# EasyEDA Pro project ProPrj_时移LLC开发板_2025-06-07.epro, board PCB1_1
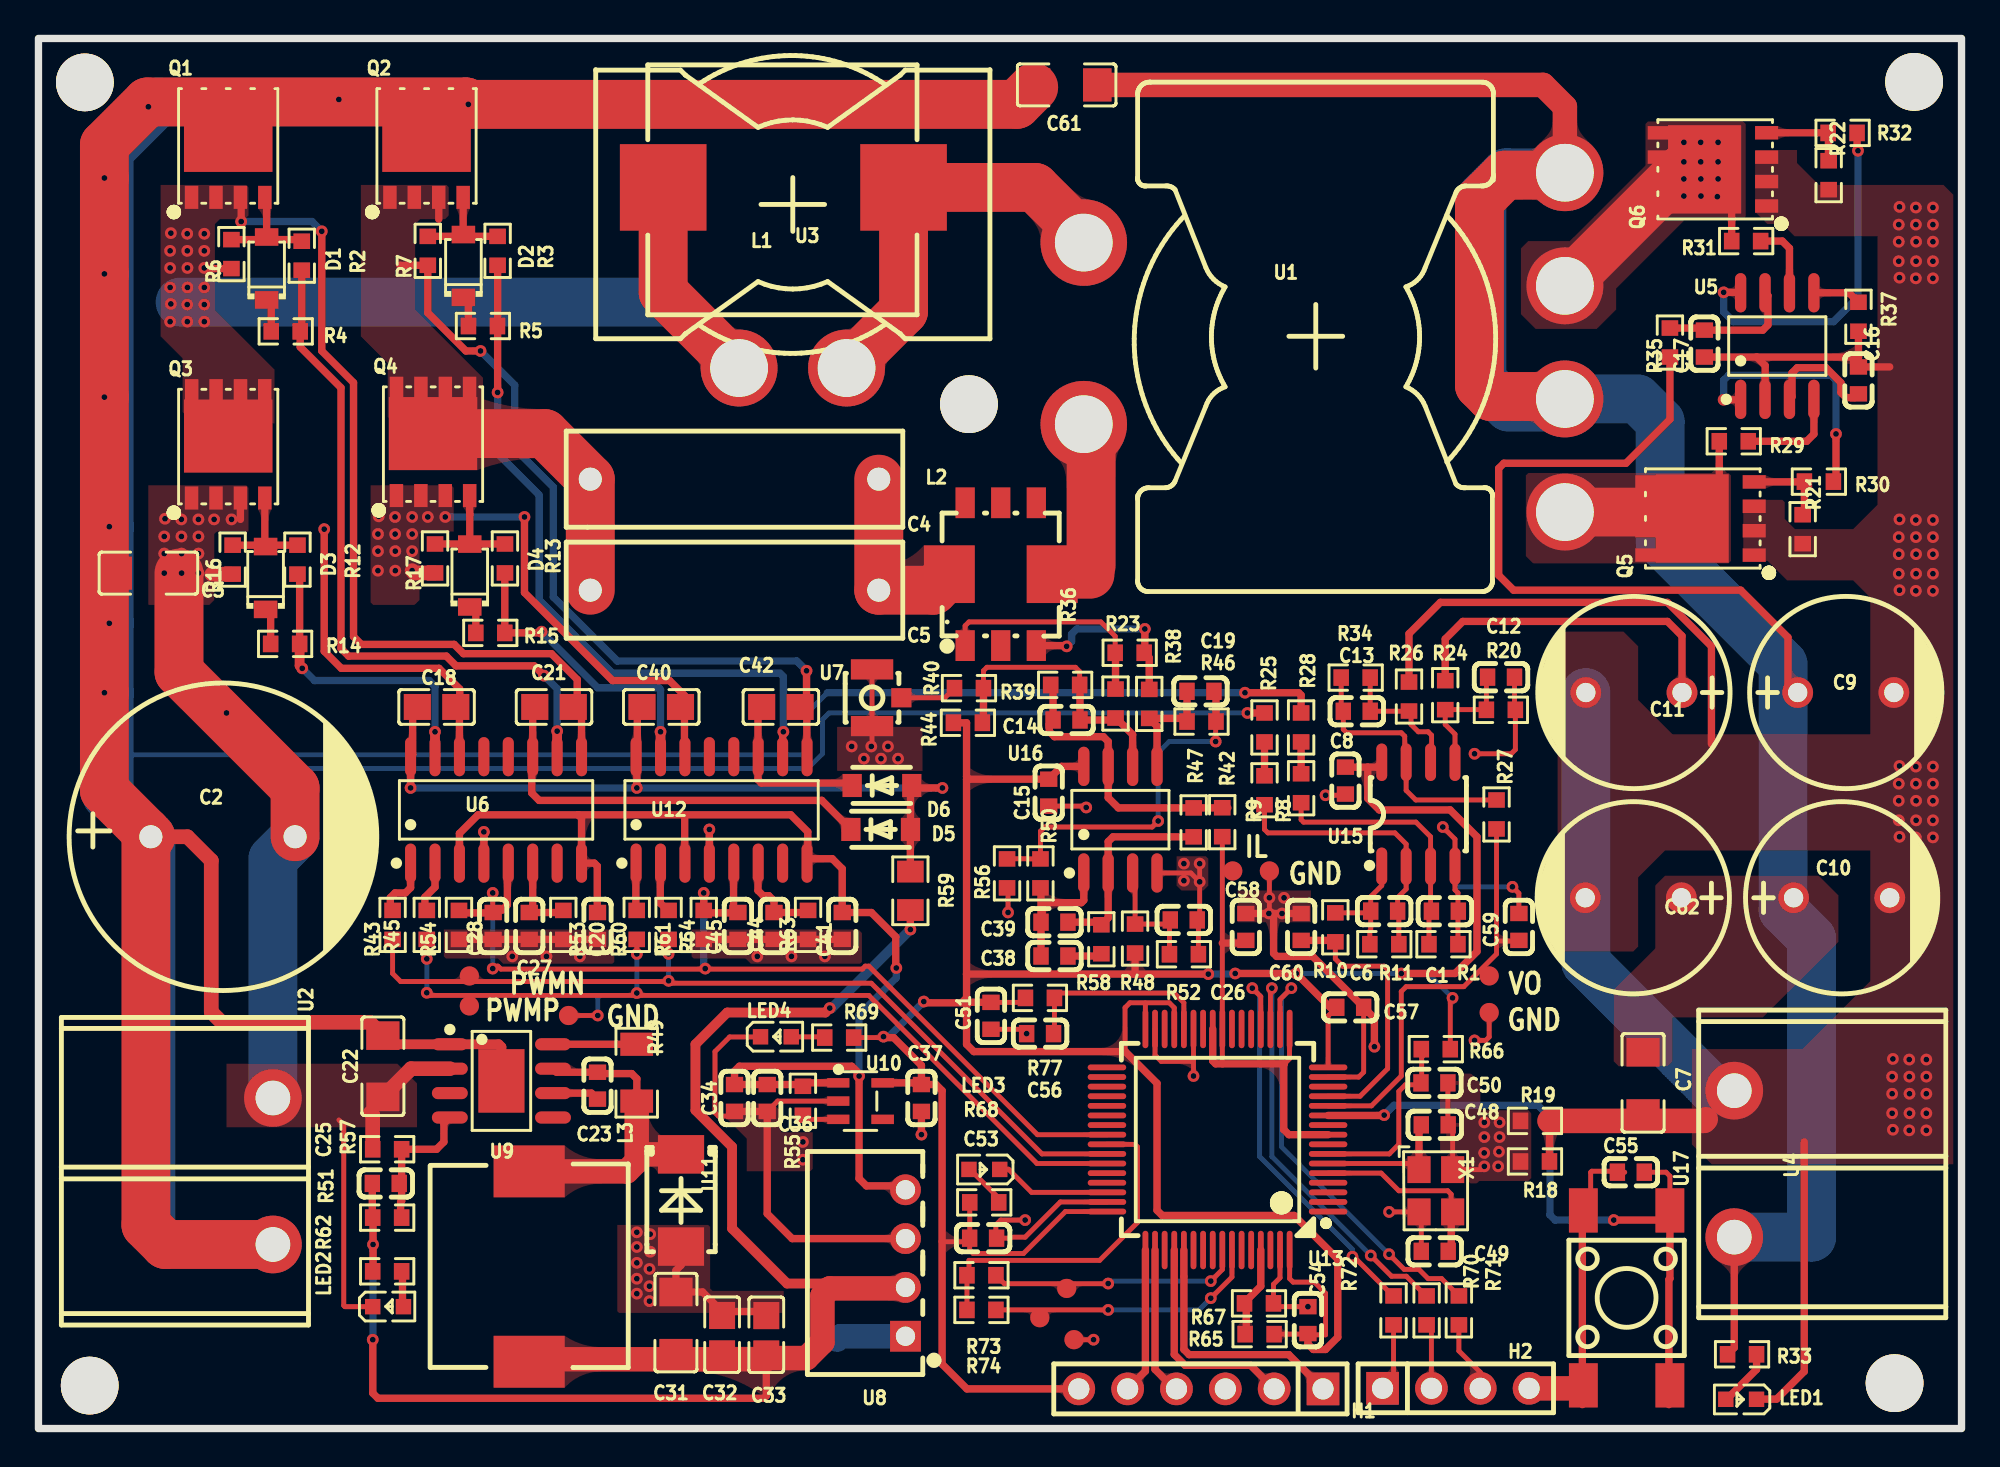
[diagram p1: board, top side]
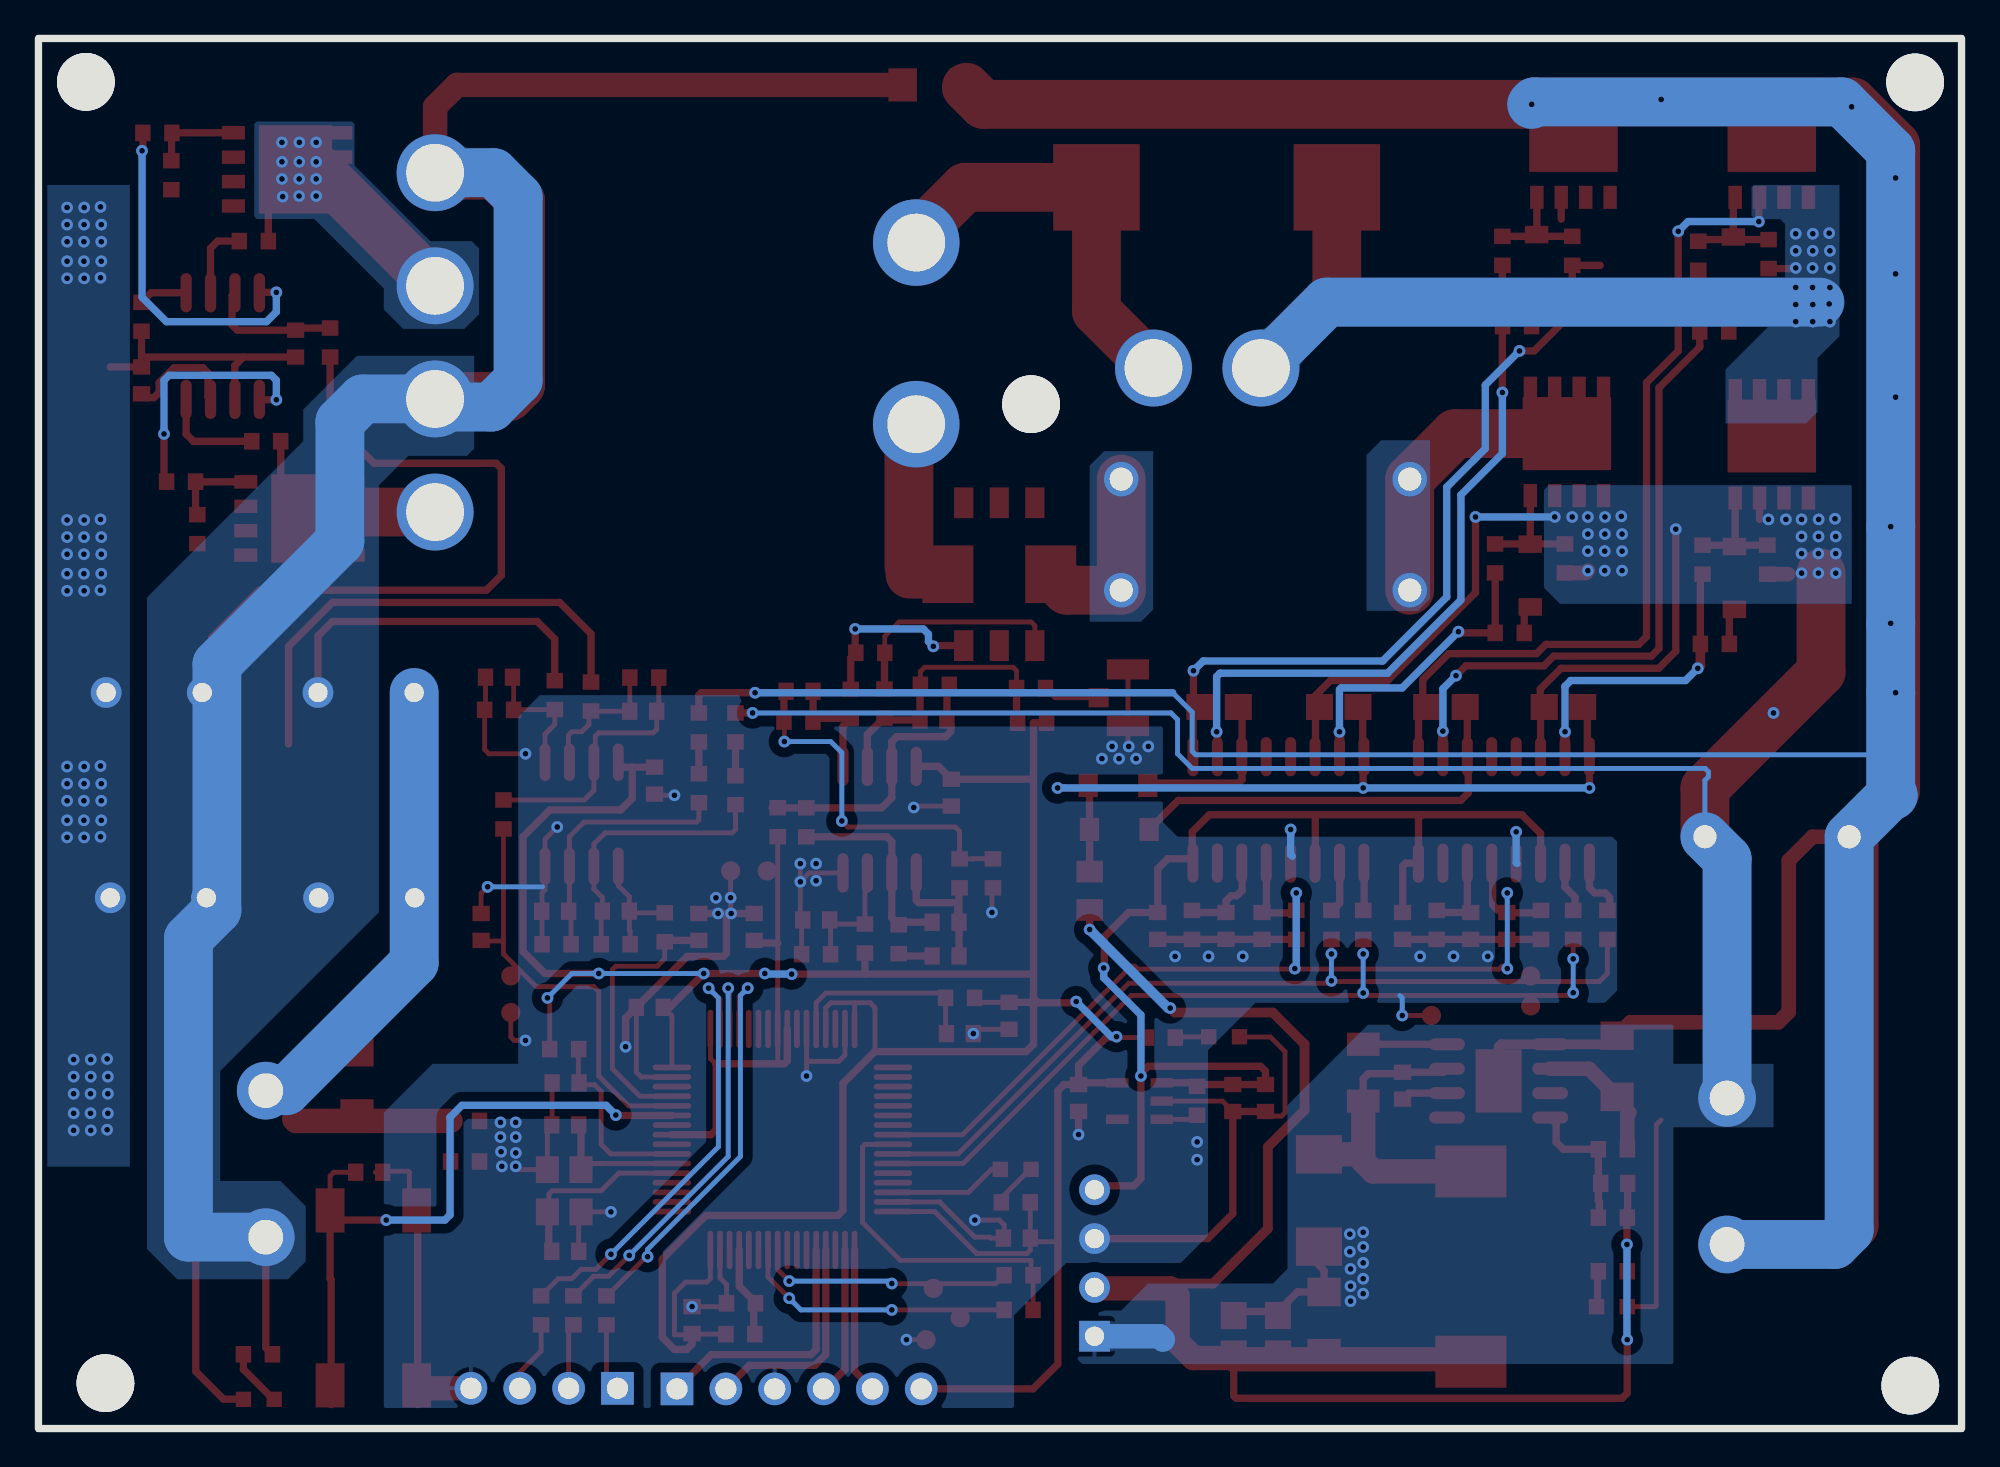
[diagram p2: board, bottom side, seen from below]

Outline 100 x 72.31 mm; copper layers: Top Layer, Bottom Layer. Coordinates in mm from the lower left corner of the outline.
Outline path: rectangle 0,72.31 100,0
Stack: Top Layer 0.035mm / Dielectric1 1.51mm FR4 er 4.5 / Bottom Layer 0.035mm

## Design rules (mm)
template: 自定义配置
spacing copperThickness1oz (default): track to track 0.102, other pairs 0.152 to 0.3
spacing copperThickness2oz: track to track 0.203, other pairs 0.152 to 0.3
track width copperThickness1oz (default): min 0.127, default 0.254, max 2.54
track width copperThickness2oz: min 0.203, default 0.254, max 2.54
differential pair differentialPair (default): width min 0.127, default 0.254, max 2.54; gap min 0.152, default 0.152
via viaSize (default): diameter min 0.5, default 0.61, max 10; hole min 0.3, default 0.305, max 6.299

## Placement (name value [footprint] x y rotation side)
C1  1nF  [C0603]  73.13 26.91 0 top
C2  470uF  [CAP-TH_BD16.0-P7.50-D1.2-FD]  9.59 30.78 0 top
C3  100nF  [C1206]  5.72 44.5 180 top
C4  100nF  [CAP-TH_L17.5-W5.0-P15.00-D1.2]  36.19 49.39 180 top
C5  100nF  [CAP-TH_L17.5-W5.0-P15.00-D1.2]  36.19 43.61 180 top
C6  1nF  [C0603]  69.98 26.92 180 top
C7  1uF  [C1206]  83.44 17.98 90 top
C8  100nF  [C0603]  67.96 33.71 90 top
C9  1000uF  [CAP-TH_BD10.0-P5.00-D0.6-FD-A]  93.98 38.29 0 top
C10  1000uF  [CAP-TH_BD10.0-P5.00-D0.6-FD-A]  93.77 27.61 0 top
C11  1000uF  [CAP-TH_BD10.0-P5.00-D0.6-FD-A]  82.96 38.29 180 top
C12  1nF  [C0603]  76.05 39.09 0 top
C13  1nF  [C0603]  68.55 37.31 180 top
C14  100pF  [C0603]  53.46 36.86 180 top
C15  100nF  [C0603]  52.53 33.08 90 top
C16  1uF  [C0603]  94.64 54.53 270 top
C17  1uF  [C0603]  86.63 56.44 90 top
C18  100nF  [C0805]  20.7 37.54 180 top
C19  100pF  [C0603]  60.42 38.35 0 top
C20  100nF  [C0603]  29.07 26.14 90 top
C21  1uF  [C0805]  26.81 37.54 180 top
C22  1uF  [C1206]  17.91 18.85 90 top
C23  100nF  [C0603]  29.07 17.84 90 top
C25  10nF  [C0603]  18.06 12.75 180 top
C26  10nF  [C0603]  59.56 26.46 180 top
C27  10nF  [C0603]  25.52 26.14 90 top
C28  10nF  [C0603]  23.64 26.14 90 top
C31  100nF  [C1206]  33.15 5.51 270 top
C32  10uF  [C0805]  35.55 4.88 270 top
C33  100nF  [C0805]  37.85 4.88 270 top
C34  4.7uF  [C0603]  36.19 17.2 90 top
C36  100nF  [C0603]  37.9 17.2 90 top
C37  1uF  [C0603]  45.91 17.2 90 top
C38  100nF  [C0603]  52.83 24.58 180 top
C39  100nF  [C0603]  52.83 26.34 180 top
C40  100nF  [C0805]  32.38 37.54 180 top
C41  100nF  [C0603]  41.8 26.14 90 top
C42  1uF  [C0805]  38.61 37.54 180 top
C44  10nF  [C0603]  38.25 26.14 90 top
C45  10nF  [C0603]  36.37 26.14 90 top
C48  100nF  [C0603]  72.59 17.98 180 top
C49  22pF  [C0603]  72.61 9.22 0 top
C50  22pF  [C0603]  72.61 15.8 0 top
C51  100nF  [C0603]  49.53 21.47 90 top
C53  100nF  [C0603]  49.12 9.91 180 top
C54  100nF  [C0603]  66.01 5.64 270 top
C55  100nF  [C0603]  82.8 13.33 0 top
C56  1uF  [C0603]  52.09 20.55 0 top
C57  100nF  [C0603]  68.21 21.91 180 top
C58  100pF  [C0603]  62.78 26.09 90 top
C59  10nF  [C0603]  76.98 26.09 90 top
C60  1nF  [C0603]  65.66 26.09 90 top
C61  100nF  [C1206]  53.47 69.9 180 top
C62  1000uF  [CAP-TH_BD10.0-P5.00-D0.6-FD-A]  82.93 27.61 180 top
D1  1N5819W  [SOD-123_L2.7-W1.6-LS3.7-RD]  11.86 60.35 90 top
D2  1N5819W  [SOD-123_L2.7-W1.6-LS3.7-RD]  22.1 60.48 90 top
D3  1N5819W  [SOD-123_L2.7-W1.6-LS3.7-RD]  11.81 44.25 90 top
D4  1N5819W  [SOD-123_L2.7-W1.6-LS3.7-RD]  22.43 44.37 90 top
D5  ES1JW  [SOD-123F_L2.8-W1.8-LS3.7-RD]  43.8 31.17 0 top
D6  ES1JW  [SOD-123F_L2.8-W1.8-LS3.7-RD]  43.86 33.45 0 top
H1  PZ254V-11-06P  [HDR-TH_6P-P2.54-V-M]  60.45 2.06 180 top
H2  PZ254V-11-04P  [HDR-TH_4P-P2.54-V-M]  73.7 2.09 0 top
L1  15uH  [IND-SMD_L13.8-W12.6]  38.74 64.57 0 top
L2  FC-SCT5.0-1:100-20A  [IND-SMD_6P-L6.2-W6.0-P1.85-LS8.1_FC-SCT5.0-1]  50.04 44.44 0 top
L3  330uH  [IND-SMD_L10.5-W10.3_SLD10D50]  25.52 8.43 270 top
LED1  KT-0603R  [LED0603-RD]  88.54 1.52 180 top
LED2  LTST-C190KGKT  [LED0603-RD]  18.18 6.34 0 top
LED3  KT-0603R  [LED0603-RD]  49.19 13.48 180 top
LED4  KT-0603R  [LED0603-RD]  38.35 20.38 0 top
NOREF  -  [Pad_e3116]  22.41 21.99 0 top
NOREF#2  -  [Pad_e3285]  52.07 5.77 0 top
NOREF#3  -  [Pad_e338]  48.38 53.29 0 top
NOREF#4  -  [Pad_e3133]  64.01 29.01 0 top
NOREF#5  -  [Pad_e3126]  75.44 21.64 0 top
NOREF#6  -  [Pad_e3125]  75.44 23.55 0 top
NOREF#7  -  [Pad_e3120]  27.57 21.49 0 top
NOREF#8  -  [Pad_e240]  96.52 2.36 0 top
NOREF#9  -  [Pad_e3132]  62.1 29.01 0 top
NOREF#10  -  [Pad_e250]  97.53 70.05 0 top
NOREF#11  -  [Pad_e251]  2.41 70.03 0 top
NOREF#12  -  [Pad_e337]  2.67 2.24 0 top
NOREF#13  -  [Pad_e3287]  53.85 4.62 0 top
NOREF#14  -  [Pad_e3117]  22.41 23.55 0 top
NOREF#15  -  [Pad_e3286]  53.47 7.29 0 top
Q1  AGM4025A  [PDFN-8_L5.8-W4.9-P1.27-LS6.1-BL]  9.87 66.84 0 top
Q2  AGM4025A  [PDFN-8_L5.8-W4.9-P1.27-LS6.1-BL]  20.18 66.84 0 top
Q3  AGM4025A  [PDFN-8_L5.8-W4.9-P1.27-LS6.1-BL]  9.87 51.2 0 top
Q4  AGM4025A  [PDFN-8_L5.8-W4.9-P1.27-LS6.1-BL]  20.52 51.33 0 top
Q5  AGM4025A  [PDFN-8_L5.8-W4.9-P1.27-LS6.1-BL]  86.43 47.34 90 top
Q6  AGM4025A  [PDFN-8_L5.8-W4.9-P1.27-LS6.1-BL]  87.07 65.5 90 top
R1  2kΩ  [R0603]  73.06 25.2 0 top
R2  10Ω  [R0603]  13.69 61.01 270 top
R3  10Ω  [R0603]  23.88 61.27 270 top
R4  10Ω  [R0603]  12.86 57.08 0 top
R5  10Ω  [R0603]  23.11 57.35 0 top
R6  10kΩ  [R0603]  10.03 61.1 270 top
R7  10kΩ  [R0603]  20.25 61.27 270 top
R8  10kΩ  [R0603]  65.66 33.31 270 top
R9  10kΩ  [R0603]  63.75 33.2 270 top
R10  100Ω  [R0603]  67.44 26.08 270 top
R11  2kΩ  [R0603]  69.98 25.2 0 top
R12  10Ω  [R0603]  13.47 45.2 270 top
R13  10Ω  [R0603]  24.26 45.26 270 top
R14  10Ω  [R0603]  12.83 40.82 0 top
R15  10Ω  [R0603]  23.5 41.39 0 top
R16  10kΩ  [R0603]  10.1 45.2 270 top
R17  10kΩ  [R0603]  20.62 45.26 270 top
R18  0Ω  [R0603]  77.82 13.89 0 top
R19  0Ω  [R0603]  77.82 16 0 top
R20  1kΩ  [R0603]  76.05 37.39 0 top
R21  10kΩ  [R0603]  91.74 46.79 270 top
R22  10kΩ  [R0603]  93.09 65.2 270 top
R23  2.2Ω  [R0603]  56.74 40.36 180 top
R24  10kΩ  [R0603]  73.15 38.15 270 top
R25  47kΩ  [R0603]  63.75 36.47 90 top
R26  10kΩ  [R0603]  71.27 38.08 270 top
R27  100Ω  [R0603]  75.82 31.95 270 top
R28  47kΩ  [R0603]  65.66 36.47 90 top
R29  1kΩ  [R0603]  88.16 51.36 180 top
R30  10Ω  [R0603]  92.58 49.26 180 top
R31  1kΩ  [R0603]  88.8 61.77 180 top
R32  10Ω  [R0603]  93.82 67.4 180 top
R33  47kΩ  [R0603]  88.59 3.86 0 top
R34  1kΩ  [R0603]  68.5 39.06 180 top
R35  10Ω  [R0603]  84.84 56.49 270 top
R36  1kΩ  [R0603]  56.01 37.71 270 top
R37  100Ω  [R0603]  94.64 57.84 90 top
R38  1kΩ  [R0603]  57.76 37.7 270 top
R39  4.7kΩ  [R0603]  53.39 38.68 180 top
R40  1kΩ  [R0603]  48.39 38.52 0 top
R42  100Ω  [R0603]  61.56 31.54 270 top
R43  100Ω  [R0603]  18.42 26.2 90 top
R44  1kΩ  [R0603]  48.33 36.71 0 top
R45  100Ω  [R0603]  20.19 26.2 90 top
R46  4.7kΩ  [R0603]  60.48 36.78 0 top
R47  470kΩ  [R0603]  60.07 31.53 90 top
R48  10kΩ  [R0603]  57.02 25.49 270 top
R49  100mΩ  [R1206]  31.11 18.51 90 top
R50  10Ω  [R0603]  52.1 28.88 270 top
R51  8.2kΩ  [R0603]  18.13 10.97 180 top
R52  10kΩ  [R0603]  59.56 24.67 180 top
R53  10kΩ  [R0603]  27.29 26.2 90 top
R54  10kΩ  [R0603]  21.87 26.2 270 top
R55  10kΩ  [R0603]  39.75 17.05 90 top
R56  10kΩ  [R0603]  50.37 28.88 90 top
R57  1kΩ  [R0603]  18.13 14.53 0 top
R58  470Ω  [R0603]  55.27 25.45 270 top
R59  4.7Ω  [R0805]  45.34 27.97 90 top
R60  100Ω  [R0603]  31.11 26.2 90 top
R61  100Ω  [R0603]  32.77 26.2 90 top
R62  47kΩ  [R0603]  18.13 8.18 180 top
R63  10kΩ  [R0603]  40.02 26.2 90 top
R64  10kΩ  [R0603]  34.59 26.2 270 top
R65  OFF  [R0603]  63.5 4.91 0 top
R66  10kΩ  [R0603]  72.66 19.74 0 top
R67  10kΩ  [R0603]  63.47 6.51 180 top
R68  10kΩ  [R0603]  49.18 11.77 0 top
R69  10kΩ  [R0603]  41.64 20.34 180 top
R70  10kΩ  [R0603]  73.86 6.15 270 top
R71  10kΩ  [R0603]  72.18 6.15 270 top
R72  10kΩ  [R0603]  70.46 6.15 270 top
R73  10kΩ  [R0603]  49.03 6.17 180 top
R74  10kΩ  [R0603]  49.03 7.97 180 top
R77  10Ω  [R0603]  52.08 22.4 0 top
U1  -  [PQ2625_中心抽头]  66.42 56.82 0 top
U2  DBT10-7.62-2P-GN-P  [CONN-TH_2P-P7.62_DBT10-7.62-2P]  12.19 13.39 270 top
U3  -  [PQ2016_无骨架电感]  39.23 63.68 0 top
U4  DBT10-7.62-2P-GN-P  [CONN-TH_2P-P7.62_DBT10-7.62-2P]  88.18 13.77 90 top
U5  UCC24624DR  [SOIC-8_L4.9-W3.9-P1.27-LS6.0-BL]  90.42 56.31 0 top
U6  NSI6602B-DSPNR  [SOP-16_L9.9-W3.9-P1.27-LS6.0-BL]  23.8 32.18 0 top
U7  BWU.FL-IPEX1  [IPEX-SMD_BWIPX-1-001E]  44.11 38.02 180 top
U8  B1205S-1W  [PWRM-TH_BXXXXS-1W]  45.09 8.61 90 top
U9  EG1198  [ESOP-8_L4.9-W3.9-P1.27-LS6.0-BL-EP-1]  24.07 18.09 270 top
U10  LP5907MFX-3.0/NOPB  [SOT-23-5_L3.0-W1.7-P0.95-LS2.8-BL]  42.74 17.03 270 top
U11  UF2G  [SMB_L4.4-W3.6-LS5.3-RD]  33.41 11.87 270 top
U12  NSI6602B-DSPNR  [SOP-16_L9.9-W3.9-P1.27-LS6.0-BL]  35.52 32.18 0 top
U13  STM32G474RCT6  [LQFP-64_L10.0-W10.0-P0.50-LS12.0-BL]  61.31 15.04 90 top
U15  TLV9062IDR  [SOIC-8_L5.0-W4.0-P1.27-LS6.0-BL]  71.75 31.96 0 top
U16  OPA2365AIDR  [SOIC-8_L4.9-W3.9-P1.27-LS6.0-BL]  56.26 31.67 0 top
U17  HX TS666TP 250gf 009  [SW-SMD_4P-L6.0-W6.0-P4.50-LS9.0-2]  82.58 6.8 270 top
X1  8MHz  [OSC-SMD_4P-L3.2-W2.5-BL]  72.66 12.37 270 top

## Footprints (pads in the part's own frame, mm; a bottom-side part is the same pattern mirrored in y, then rotated)
C0603
  rect 0.8x0.9 smd: 1(-0.7,0) 2(0.7,0)
C0805
  rect 1.41x1.35 smd: 1(-1,0) 2(1,0)
C1206
  rect 1.485x1.728 smd: 1(-1.593,0) 2(1.593,0)
CAP-TH_BD10.0-P5.00-D0.6-FD-A
  round 1.6 hole 1: 1(-2.5,0) 2(2.5,0)
CAP-TH_BD16.0-P7.50-D1.2-FD
  round 2.2 hole 1.2: 1(-3.75,0) 2(3.75,0)
CAP-TH_L17.5-W5.0-P15.00-D1.2
  round 1.8 hole 1.2: 1(-7.5,0) 2(7.5,0)
CONN-TH_2P-P7.62_DBT10-7.62-2P
  round 3 hole 1.8: 1(-3.81,0) 2(3.81,0)
ESOP-8_L4.9-W3.9-P1.27-LS6.0-BL-EP-1
  oval 0.63x1.865 smd: 1(-1.905,-2.683) 2(-0.635,-2.683) 3(0.635,-2.683) 4(1.905,-2.683) 5(1.905,2.683) 6(0.635,2.683) 7(-0.635,2.683) 8(-1.905,2.683)
  rect 3.3x2.4 smd: 9(0,0)
HDR-TH_4P-P2.54-V-M
  rect 1.7x1.7 hole 1.1: 1(-3.81,0)
  round 1.7 hole 1.1: 2(-1.27,0) 3(1.27,0) 4(3.81,0)
HDR-TH_6P-P2.54-V-M
  rect 1.7x1.7 hole 1.1: 1(-6.35,0)
  round 1.7 hole 1.1: 2(-3.81,0) 3(-1.27,0) 4(1.27,0) 5(3.81,0) 6(6.35,0)
IND-SMD_6P-L6.2-W6.0-P1.85-LS8.1_FC-SCT5.0-1
  rect 1x1.6 smd: 1(-1.85,-3.715) 2(0,-3.715) 3(1.85,-3.715) 4(1.85,3.715) 5(0,3.715) 6(-1.85,3.715)
  rect 2.65x3 smd: 7(2.675,0) 8(-2.675,0)
IND-SMD_L10.5-W10.3_SLD10D50
  rect 2.7x3.7 smd: 1(-4.95,0) 2(4.95,0)
IND-SMD_L13.8-W12.6
  rect 4.5x4.5 smd: 1(-6.25,0) 2(6.25,0)
IPEX-SMD_BWIPX-1-001E
  rect 1.05x1 smd: 1(-0.762,0)
  rect 2.2x1.05 smd: 2(0.762,-1.475) 3(0.762,1.475)
LED0603-RD
  rect 0.8x0.8 smd: 1(-0.799,0) 2(0.799,0)
LQFP-64_L10.0-W10.0-P0.50-LS12.0-BL
  oval 0.3x2 smd: 1(-3.75,-5.75) 2(-3.25,-5.75) 3(-2.75,-5.75) 4(-2.25,-5.75) 5(-1.75,-5.75) 6(-1.25,-5.75) 7(-0.75,-5.75) 8(-0.25,-5.75) 9(0.25,-5.75) 10(0.75,-5.75) 11(1.25,-5.75) 12(1.75,-5.75) 13(2.25,-5.75) 14(2.75,-5.75) 15(3.25,-5.75) 16(3.75,-5.75) 33(3.75,5.75) 34(3.25,5.75) 35(2.75,5.75) 36(2.25,5.75) 37(1.75,5.75) 38(1.25,5.75) 39(0.75,5.75) 40(0.25,5.75) 41(-0.25,5.75) 42(-0.75,5.75) 43(-1.25,5.75) 44(-1.75,5.75) 45(-2.25,5.75) 46(-2.75,5.75) 47(-3.25,5.75) 48(-3.75,5.75)
  oval 2x0.3 smd: 17(5.75,-3.75) 18(5.75,-3.25) 19(5.75,-2.75) 20(5.75,-2.25) 21(5.75,-1.75) 22(5.75,-1.25) 23(5.75,-0.75) 24(5.75,-0.25) 25(5.75,0.25) 26(5.75,0.75) 27(5.75,1.25) 28(5.75,1.75) 29(5.75,2.25) 30(5.75,2.75) 31(5.75,3.25) 32(5.75,3.75) 49(-5.75,3.75) 50(-5.75,3.25) 51(-5.75,2.75) 52(-5.75,2.25) 53(-5.75,1.75) 54(-5.75,1.25) 55(-5.75,0.75) 56(-5.75,0.25) 57(-5.75,-0.25) 58(-5.75,-0.75) 59(-5.75,-1.25) 60(-5.75,-1.75) 61(-5.75,-2.25) 62(-5.75,-2.75) 63(-5.75,-3.25) 64(-5.75,-3.75)
OSC-SMD_4P-L3.2-W2.5-BL
  rect 1.4x1.2 smd: 1(-1.1,-0.875) 2(1.1,-0.875) 3(1.1,0.875) 4(-1.1,0.875)
Pad_e240
  round 3 hole 3: 1(0,0)
Pad_e250
  round 3 hole 3: 1(0,0)
Pad_e251
  round 3 hole 3: 1(0,0)
Pad_e337
  round 3 hole 3: 1(0,0)
Pad_e338
  round 3 hole 3: 1(0,0)
Pad_e3116
  round 1 smd: 2(0,0)
Pad_e3117
  round 1 smd: 2(0,0)
Pad_e3120
  round 1 smd: 2(0,0)
Pad_e3125
  round 1 smd: 2(0,0)
Pad_e3126
  round 1 smd: 2(0,0)
Pad_e3132
  round 1 smd: 2(0,0)
Pad_e3133
  round 1 smd: 2(0,0)
Pad_e3285
  round 1 smd: 2(0,0)
Pad_e3286
  round 1 smd: 2(0,0)
Pad_e3287
  round 1 smd: 2(0,0)
PDFN-8_L5.8-W4.9-P1.27-LS6.1-BL
  rect 0.7x1.2 smd: 1(-1.905,-2.792) 2(-0.635,-2.792) 3(0.635,-2.792) 4(1.905,-2.792) 5(1.9,2.792) 6(0.64,2.792) 7(-0.63,2.792) 8(-1.9,2.792)
  rect 4.6x3.8 smd: 9(0,0.432)
PQ2016_无骨架电感
  round 4 hole 3x2.8: 1(-2.794,-8.509) 2(2.794,-8.509)
PQ2625_中心抽头
  round 4.5 hole 3: 1(-12.065,4.875) 2(-12.065,-4.572)
  round 4 hole 3: 3(12.954,-9.144) 4(12.954,-3.26) 5(12.954,2.624) 6(12.954,8.509)
PWRM-TH_BXXXXS-1W
  rect 1.6x1.6 hole 1: 1(-3.81,0)
  round 1.6 hole 1: 2(-1.27,0) 3(1.27,0) 4(3.81,0)
R0603
  rect 0.806x0.864 smd: 1(-0.753,0) 2(0.753,0)
R0805
  rect 1.133x1.377 smd: 1(-1,0) 2(1,0)
R1206
  rect 1.208x1.701 smd: 1(-1.479,0) 2(1.479,0)
SMB_L4.4-W3.6-LS5.3-RD
  rect 2x2.4 smd: 1(-2.4,0) 2(2.4,0)
SOD-123_L2.7-W1.6-LS3.7-RD
  rect 0.91x1.22 smd: 1(-1.635,0) 2(1.635,0)
SOD-123F_L2.8-W1.8-LS3.7-RD
  rect 1x1.2 smd: 1(-1.55,0) 2(1.55,0)
SOIC-8_L4.9-W3.9-P1.27-LS6.0-BL
  oval 0.588x2.045 smd: 1(-1.905,-2.772) 2(-0.635,-2.772) 3(0.635,-2.772) 4(1.905,-2.772) 5(1.905,2.772) 6(0.635,2.772) 7(-0.635,2.772) 8(-1.905,2.772)
SOIC-8_L5.0-W4.0-P1.27-LS6.0-BL
  oval 0.569x1.95 smd: 1(-1.905,-2.705) 2(-0.635,-2.705) 3(0.635,-2.705) 4(1.905,-2.705) 5(1.905,2.705) 6(0.635,2.705) 7(-0.635,2.705) 8(-1.905,2.705)
SOP-16_L9.9-W3.9-P1.27-LS6.0-BL
  oval 0.574x2.038 smd: 1(-4.445,-2.769) 2(-3.175,-2.769) 3(-1.905,-2.769) 4(-0.635,-2.769) 5(0.635,-2.769) 6(1.905,-2.769) 7(3.175,-2.769) 8(4.445,-2.769) 9(4.445,2.769) 10(3.175,2.769) 11(1.905,2.769) 12(0.635,2.769) 13(-0.635,2.769) 14(-1.905,2.769) 15(-3.175,2.769) 16(-4.445,2.769)
SOT-23-5_L3.0-W1.7-P0.95-LS2.8-BL
  rect 0.49x1.157 smd: 1(-0.95,-1.153) 2(0,-1.153) 3(0.95,-1.153)
  rect 0.49x1.175 smd: 4(0.95,1.153) 5(-0.95,1.153)
SW-SMD_4P-L6.0-W6.0-P4.50-LS9.0-2
  rect 2.3x1.5 smd: 1(-4.55,2.25) 2(4.55,2.25) 3(-4.55,-2.25) 4(4.55,-2.25)

## Nets
As in the schematic, except:
AGND: C1.2 C8.1 C12.2 C15.1 C20.1 C26.1 C27.1 C28.1 C34.1 C36.1 C37.1 C41.1 C44.1 C45.1 C48.1 C49.1 C50.2 C51.1 C53.1 C54.1 C55.1 C56.1 C57.1 C58.2 C59.2 C60.2 H1.3 H2.4 LED4.1 NOREF#4.2 NOREF#5.2 NOREF#7.2 NOREF#13.2 R1.2 R18.1 R19.1 R20.2 R52.1 R53.1 R54.2 R56.1 R63.1 R64.2 R67.1 U6.4 U7.2 U7.3 U8.3 U10.2 U12.4 U13.15 U13.27 U13.31 U13.47 U13.63 U15.4 U16.4 U17.3 U17.4 X1.2 X1.4
IL_MCU: C58.1 NOREF#9.2 R42.2 U13.9 U13.17 U13.24 U13.25
PWMN: NOREF#14.2 R43.1 R61.1 U13.42
PWMP: NOREF.2 R45.1 R60.1 U13.43
VOUT_MCU: C59.1 NOREF#6.2 R27.2 U13.12
$1N4788: D4.1 R15.1
$1N4863: D4.2 Q4.4 R13.1 R17.1
$1N5011: D1.1 R4.1
$1N5012: D1.2 Q1.4 R2.1 R6.1
$1N5134: D2.1 R5.1
$1N5135: D2.2 Q2.4 R3.1 R7.1
$1N5263: D3.1 R14.1
$1N5264: D3.2 Q3.4 R12.1 R16.1
$1N42624: NOREF#2.2 R73.1 U13.58
$1N42658: NOREF#15.2 R74.1 U13.57

Pads without a net: L2 2 4 5 6; NOREF#3 1; NOREF#8 1; NOREF#10 1; NOREF#11 1; NOREF#12 1; U6 7 12 13; U9 3 5; U10 4; U12 7 12 13; U13 1 2 3 4 8 10 14 21 26 30 33 34 35 36 37 38 39 44 45 51 54 55 56 59 60 62

## Via types
v1: diameter 0.61, hole 0.305, Top Layer to Bottom Layer, 248 vias

## Routing (per net, layer and track width the routed paths; a pad name or vN(x,y) marks a point on that pad's centre or on a via; arc(x,y) is an arc through that point)
3V3_C: length 181.7
  Top Layer w0.254: U13.48 53.4,11.29 51.22,9.11 48.6,9.11 48.42,9.29 48.42,9.91 ; U13.29 59.06,21.89 58.8,22.15 56.76,22.15 56.5,21.89 56.5,19.62 ; C51.2 51.09,22.17 51.32,22.4 ; R65.2 65.98,4.91 C54.2 66.08,4.88 66.93,4.88 66.93,7.04 66.35,7.62 65.24,7.62 65.06,7.8 U13.64 ; R68.1 48.43,9.91 48.42,9.91 ; 48.42,9.91 48.24,9.72 46.99,9.72 ; R69.1 43.94,20.34 ; 67.51,21.91 67.06,21.46 U13.16 ; R66.2 73.42,22.29 v1(73.53,22.4) ; U13.32 57.56,22.14 ; 45.62,17.9 45.85,17.67 ; 44.3,17.98 U10.5
  Top Layer w0.381: C37.2 45.91,18.89 44.47,20.34 43.94,20.34 43.96,20.36 43.96,20.37 v1(43.94,20.39) ; C37.2 46.67,17.9 46.99,17.58 46.99,3.35 48.28,2.06 H1.6 ; C37.2 45.62,17.9 45.53,17.98 44.3,17.98 ; 69.12,34.41 69.59,34.41 U15.8 ; 69.12,34.41 69.12,32.78 69.72,32.18 73.41,32.18 74.8,30.78 74.8,24.82 73.66,23.67 v1(70.87,23.67) ; 69.12,34.41 C8.2 ; 67.51,21.91 67.17,21.91 v1(65.41,23.67) v1(62.23,23.67) ; 56.99,23.64 v1(60.83,23.64) ; 56.99,23.64 48.26,23.64 ; 56.99,23.64 57.02,23.67 R48.2 ; v1(46.04,22.21) 46.1,22.15 48.01,22.15 48.26,22.4 ; 48.39,33.78 48.26,33.91 48.26,36.71 R44.1 ; 48.39,33.78 48.26,33.78 48.26,23.64 ; 48.39,33.78 C15.2 53.2,34.45 U16.8 ; 48.26,22.02 48.41,22.17 C51.2 ; 48.26,22.02 48.26,22.4 ; 48.26,22.02 48.26,19.99 48.64,19.61 56.51,19.61 58.17,17.96 58.17,11.35 58.44,11.08 65.29,11.08 67.56,8.81 67.56,4.75 66.93,4.12 66.29,4.12 66.01,4.4 C54.2 ; 48.26,23.64 48.26,22.4
  Bottom Layer w0.254: v1(65.41,23.67) v1(70.87,23.67) 72.26,23.67 v1(73.53,22.4)
  Bottom Layer w0.381: v1(60.83,23.64) 62.2,23.64 v1(62.23,23.67) ; v1(46.04,22.21) 44.21,20.39 v1(43.94,20.39)
+5V_C: length 66.7
  Top Layer w0.381: 40,29.59 40.06,29.64 41.28,29.64 41.8,29.12 C41.2 43.31,26.84 44.58,25.58 44.58,23.99 v1(44.61,23.96) ; 40,29.59 39.95,29.54 ; 40,29.59 40,31.04 39.12,31.93 28.07,31.93 ; 28.07,31.93 28.06,31.92 28.06,31.93 22.86,31.93 21.89,30.96 U6.3 ; 28.07,31.93 28.24,31.75 U6.8 28.91,29.41 29.06,29.26 29.06,26.86 C20.2 ; U10.1 39.93,17.98 R55.2 39.66,17.9 C36.2 C34.2 36.19,18.59 36.45,18.85 42.29,18.85 42.67,18.47 42.67,13 43.05,12.62 44.88,12.62 U8.4 ; 33.6,29.54 33.6,31.71
  Bottom Layer w0.381: v1(42.67,18.34) 42.67,21.51 44.61,23.45 v1(44.61,23.96)
+12V_C: length 89
  Top Layer w0.381: C25.2 17.36,11.01 17.33,10.97 ; 37.85,3.6 37.85,1.7 37.72,1.57 17.65,1.57 17.38,1.84 v1(17.38,4.62) ; R62.2 17.4,8.2 v1(17.4,9.58) 17.4,10.95 R51.2 ; v1(45.34,25.96) R59.1
  Top Layer w0.508: 40.77,6.91 40.77,7.54 38.93,7.54 36.07,10.4 36.07,14.66 34.16,16.56 34.16,19.99 35.81,21.64 40.92,21.64 v1(41.15,21.87)
  Top Layer w1.27: U8.2 45.03,7.29 41.15,7.29 40.77,6.91 40.77,4.5 39.94,3.67 37.85,3.67 37.85,3.6 25.64,3.6 L3.2
  Bottom Layer w0.381: v1(17.38,4.62) 17.4,4.64 v1(17.4,9.58)
  Bottom Layer w0.508: v1(41.15,21.87) 41.25,21.87 v1(45.34,25.96)
AGND: length 155.6
  Top Layer w0.254: 80.71,11.35 80.71,13.33 80.77,13.39 81.78,13.39 81.83,13.33 82.49,13.33 ; v1(51.38,20.55) 51.16,20.77 C51.1 ; U10.2 38.44,17.03 C36.1 ; v1(51.31,10.85) 50.04,10.85 49.78,10.59 49.78,9.94 C53.1 50.48,9.91 50.53,9.96 51.31,9.96 53.14,11.79 U13.47 ; NOREF#7.2 v1(29.08,21.49) ; 60.06,19.22 v1(60.06,18.34) ; 60.06,19.22 U13.27 ; 60.06,19.22 59.94,19.1 58.39,19.1 58.06,19.43 U13.31 ; C34.1 35.95,16.25 35.36,16.25 35.18,16.43 35.18,19.61 35.94,20.37 37.5,20.37 ; C15.1 54.41,32.38 v1(54.48,32.31) ; R1.2 73.81,27.87 73.66,28.02 U15.4 73.66,30.66 v1(73.03,31.29) ; v1(50.42,26.85) 50.42,28.07 R56.1 ; NOREF#4.2 v1(64.01,27.61) 64.01,27.01 64.23,26.79 ; v1(66.01,6.34) 64.39,6.34 R67.1 64.22,7.5 64.56,7.84 U13.63 ; 43.35,39.49 43.35,35.52 v1(43.31,35.48) ; U16.4 59.92,28.9 v1(60.38,28.44) ; v1(60.38,28.44) 60.38,26.59 C26.1 60.32,26.4 R52.1 ; v1(60.38,28.44) v1(60.38,29.39) ; C59.2 76.98,27.84 v1(76.64,28.18) ; v1(74.68,20.19) 75.26,20.19 75.44,20.37 NOREF#5.2 ; v1(75.18,13.64) 75.01,13.47 X1.4 73.54,15.57 C50.2 73.29,15.81 C48.1 ; v1(66.93,32.94) 67.9,32.94 C8.1 ; C12.2 76.75,37.43 R20.2 76.8,35.32 76.58,35.1 v1(74.68,35.1) ; C49.1 71.91,11.15 X1.2 v1(70.23,11.27) ; 80.71,2.25 80.56,2.09 80.28,2.09 ; 73.94,26.8 C1.2 ; NOREF#13.2 v1(54.86,4.62) ; U13.15 68.66,18.29 68.91,18.54 C57.1
  Top Layer w0.381: C37.1 v1(45.91,15.29) ; 21.87,25.45 C28.1 C27.1 C20.1 ; C34.1 C36.1 37.9,11.18 39.19,9.88 U8.3 ; 34.59,25.45 C45.1 C44.1 C41.1 ; U6.4 v1(23.16,31.04) ; U12.4 v1(34.89,31.17) ; C58.2 64.23,26.79 ; 64.23,26.79 64.23,24.72 64.39,24.56 66.26,24.56 C57.1 69.47,21.35 v1(69.47,19.86) ; 64.23,26.79 v1(64.66,26.79) C60.2 ; 80.71,11.35 80.71,10.79 80.28,10.36 80.28,1.25
  Top Layer w1.27: H2.4 80.28,2.09
  Bottom Layer w0.254: v1(29.08,21.49) 29.08,22.4 29.21,22.53 ; v1(76.64,28.18) 73.79,28.18
  Bottom Layer w0.381: 23.11,29.39 23.16,29.43 v1(23.16,31.04) ; 34.8,29.77 34.89,29.86 v1(34.89,31.17)
  vias: v1(24.64,24.56) v1(26.42,24.56) v1(28.15,24.56) v1(37.38,24.56) v1(39.16,24.56) v1(39.75,14.91) v1(39.75,13.99) v1(40.89,24.56) v1(42.29,35.48) v1(42.92,34.85) v1(43.81,34.85) v1(44.17,35.48) v1(44.7,34.85) v1(59.56,29.39) v1(59.56,28.5) v1(63.98,26.79) v1(64.77,27.61) v1(75.18,15.93) v1(75.18,15.16) v1(75.18,14.34) v1(75.9,13.64) v1(75.98,15.93) v1(75.98,15.16) v1(75.95,14.4)
VIN+: length 291.8
  Top Layer w0.381: v1(62.74,38.28) 65.53,38.28 65.66,38.15 R28.2
  Top Layer w0.508: U9.9 24.07,19.85 23.93,19.99 U9.1 18.36,19.99 C22.2
  Top Layer w0.762: C2.1 7.75,30.78 8.99,29.55 8.99,21.67 9.53,21.13 17.22,21.13 C22.2
  Top Layer w2.54: C2.1 5.59,31.04 ; 5.59,31.04 5.59,10.59 6.6,9.58 U2.2 ; 5.59,31.04 3.43,33.2 v1(3.43,38.28) v1(3.43,53.66) v1(3.43,60.07) v1(3.43,65.06) 3.43,66.77 5.67,69.01 22.22,69.01 v1(22.35,68.89) 50.86,68.89 51.75,69.77
  Bottom Layer w0.254: 4.57,34.98 4.65,35.05 39.83,35.05 40,35.23 40,37.26 41.02,38.28
  Bottom Layer w0.381: v1(62.74,38.28) 41.02,38.28 ; 3.68,38.28 v1(3.43,38.28)
  Bottom Layer w2.54: U2.2 6.6,9.58 5.84,10.34 C2.1 3.69,32.94 3.56,32.94 3.68,33.07 v1(3.68,41.89) v1(3.68,46.92) 3.68,66.47 6.22,69.01 22.22,69.01 v1(22.35,68.89)
  vias: v1(5.72,68.76) v1(15.62,69.14)
VIN-: length 158
  Top Layer w0.254: 15.62,16.05 15.88,15.8 15.88,6.4 15.94,6.34 17.38,6.34
  Top Layer w0.381: v1(14.86,46.79) 14.86,40.44 15.75,39.55 20.83,39.55 21.91,38.47 21.91,37.54 21.89,37.52 U6.14 ; R25.2 v1(62.87,37.23) ; U11.2 33.41,8.49 33.15,8.23 C31.1 34.53,7.1 35.55,6.09 37.82,6.09 37.85,6.12 ; 33.6,35.08 33.59,35.09 33.59,38.14 32.81,38.91 29.84,38.91 25.27,43.48 v1(25.27,47.42) ; Q3.3 10.5,47.3
  Top Layer w0.762: C22.1 19.38,18.72 U9.2 ; R57.1 17.38,16.33 17.27,16.43 ; v1(19.43,44.63) 19.55,44.51 R17.2 ; R16.2 9.02,44.45
  Top Layer w2.54: C3.1 7.31,39.35 13.34,33.32 C2.2
  Bottom Layer w0.254: v1(62.87,37.23) 41.11,37.23 40.77,36.88 40.77,35.1 40,34.34 13.33,34.34 13.16,34.16 13.16,33.91 13.34,33.72 C2.2
  Bottom Layer w0.381: v1(21.15,47.42) v1(25.27,47.42)
  Bottom Layer w1.27: U8.1 41.71,4.8 41.53,4.62
  Bottom Layer w2.54: C2.2 12.19,29.63 U2.1
  vias: v1(6.58,47.33) v1(6.54,46.41) v1(6.54,45.52) v1(6.54,44.5) v1(7.43,47.3) v1(7.43,46.41) v1(7.44,45.52) v1(7.44,44.5) v1(8.32,47.3) v1(8.32,46.41) v1(8.32,45.52) v1(8.32,44.5) v1(9.13,47.3) v1(9.78,37.23) v1(10.04,47.3) v1(17.69,47.45) v1(17.65,46.53) v1(17.65,45.64) v1(17.65,44.63) v1(18.54,47.42) v1(18.55,46.53) v1(18.56,45.64) v1(18.56,44.63) v1(19.43,47.42) v1(19.43,46.53) v1(19.43,45.64) v1(20.25,47.42) v1(31.12,10.21) v1(31.12,9.45) v1(31.12,8.62) v1(31.12,7.79) v1(31.12,7.02) v1(31.81,10.11) v1(31.81,9.2) v1(31.77,8.3) v1(31.77,7.41) v1(31.77,6.63)
VIN_MCU: length 14.5
  Top Layer w0.254: U13.13 68.72,17.29 70.16,18.72 70.16,23.87 69.98,24.05 67.82,24.05 67.44,24.44 R10.2
  Top Layer w0.381: C60.1 67.36,25.39 R10.2
VIN_T+: length 1.7
  Top Layer w0.381: 65.66,35.72 65.66,34.06
VIN_T-: length 1.8
  Top Layer w0.381: 63.75,35.72 R9.1
VSS1: length 87
  Top Layer w0.381: R6.2 8.67,60.34 8.64,60.38 ; U6.9 28.24,37.31 28.02,37.54 28.02,38.96 26.67,40.31 22.1,40.31 21.62,40.79 16.79,40.79 16.38,41.2 16.38,54.41 14.73,56.06 v1(14.73,62.28) ; v1(10.54,62.79) 10.54,64.01 Q1.3
  Top Layer w2.54: U3.1 32.49,59.12 L1.1
  Bottom Layer w0.381: v1(14.73,62.28) 14.22,62.79 v1(10.54,62.79)
  Bottom Layer w2.54: U3.1 33,58.6 7.37,58.6
  vias: v1(6.88,62.19) v1(6.84,61.27) v1(6.84,60.38) v1(6.84,59.36) v1(6.88,58.5) v1(6.84,57.58) v1(7.73,62.15) v1(7.74,61.27) v1(7.75,60.38) v1(7.75,59.36) v1(7.73,58.47) v1(7.74,57.58) v1(8.62,62.15) v1(8.62,61.27) v1(8.62,60.38) v1(8.62,59.36) v1(8.62,58.47) v1(8.62,57.58)
VSS2: length 57
  Top Layer w0.381: Q2.3 20.81,62.92 ; v1(39.94,39.42) 39.94,37.54 39.95,37.52 39.95,35.08 ; v1(22.99,56.06) 22.22,56.06 20.25,58.04 R7.2 18.8,60.51 18.8,60.5
  Top Layer w2.54: Q4.9 26.32,51.76 C4.2 C5.2
  Bottom Layer w0.381: v1(39.94,39.42) 39.43,39.93 30.1,39.93 26.77,43.26 26.77,48.97 24.77,50.98 24.77,54.28 v1(22.99,56.06)
BOOT0: length 4.6
  Top Layer w0.381: U13.61 63.56,7.4 62.71,6.56 62.71,6.53 62.81,6.44 62.81,5.04
DAC1_OUT1: length 23.3
  Top Layer w0.254: R70.1 72.96,7.8 72.26,7.8 71.78,8.28 71.02,8.28 v1(70.23,9.07) ; U13.18 64.56,22.32 v1(65.15,22.91)
  Bottom Layer w0.254: v1(70.23,9.07) 64.64,14.66 64.64,22.4 v1(65.15,22.91)
DAC1_OUT2: length 22
  Top Layer w0.254: v1(69.28,9) 70.36,7.93 71.13,7.93 72.15,6.9 R71.1 ; U13.19 64.06,22.84 v1(64.13,22.91)
  Bottom Layer w0.254: v1(69.28,9) 64.13,14.15 v1(64.13,22.91)
DAC2_OUT2: length 21.4
  Top Layer w0.254: U13.20 63.56,22.47 v1(63.12,22.91) ; R72.1 70.44,6.9 68.39,8.94 v1(68.33,8.94)
  Bottom Layer w0.254: v1(63.12,22.91) 63.5,22.53 63.5,14.15 68.33,9.32 v1(68.33,8.94)
DISABLE: length 55.1
  Top Layer w0.254: C28.2 23.62,26.87 v1(23.62,27.86) ; v1(23.62,23.93) 23.75,24.05 23.89,24.05 24.05,23.9 42.84,23.9 42.99,24.05 43.18,24.05 51.95,15.29 U13.40
  Top Layer w0.381: 34.59,26.83 36.35,26.83 ; 36.35,26.83 36.14,27.04 36.14,29.54 ; 36.35,26.83 C45.2 ; R64.1 v1(34.59,27.86) ; U6.5 24.38,29.37 24.38,27.24 24.11,26.98 23.77,26.98 C28.2 23.63,26.83 21.87,26.83
  Bottom Layer w0.254: v1(23.62,23.93) v1(23.62,27.86)
  Bottom Layer w0.381: v1(34.59,27.86) 34.59,24 v1(34.67,23.93)
ENA: length 36
  Top Layer w0.254: 85.21,11.35 84.84,11.72 84.84,13.13 84.63,13.33 83.88,13.33
  Top Layer w0.381: 84.78,1.25 84.78,7.75 84.84,7.8 84.84,10.85 v1(81.91,10.85) ; v1(69.98,16.31) 69.96,16.29 U13.11
  Bottom Layer w0.381: v1(81.91,10.85) 78.87,10.85 78.6,11.12 78.6,16.2 77.98,16.81 70.49,16.81 v1(69.98,16.31)
IL+: length 9.5
  Top Layer w0.381: R38.1 57.76,40.09 R23.1 57.53,40.39 v1(57.53,41.6) ; L2.3 53.43,40.73 v1(53.47,40.69)
  Bottom Layer w0.381: v1(53.47,40.69) 53.72,40.95 53.72,41.33 53.99,41.6 v1(57.53,41.6)
IL-: length 12
  Top Layer w0.254: R23.2 55.99,41.22 55.25,41.96 48.39,41.96 48.19,41.76 L2.1
  Top Layer w0.381: R36.1 56.01,40.34 R23.2
IL_MCU: length 26.4
  Top Layer w0.254: 61.57,18.97 61.56,18.98 U13.24 61.56,30.49 61.85,30.78 ; U13.17 65.05,20.78 65.05,19.24 64.78,18.97
  Top Layer w0.381: U13.25 61.06,19.13 61.21,18.97 64.78,18.97 64.75,18.94 64.75,15.56 65.02,15.29 U13.9 ; C58.1 62.64,25.25 61.56,25.25
LED5: length 6
  Top Layer w0.254: 50.04,13.49 50.44,13.49 51.65,12.29 U13.46
NRST: length 9.4
  Top Layer w0.254: 72.05,19.45 71.93,19.32 71.93,18.12 71.69,17.88 71.08,17.88 70.74,17.54 70.74,14.78 70.24,14.29 U13.7
OSC_IN: length 9.5
  Top Layer w0.254: U13.5 69.82,13.29 70.74,12.37 73.28,12.37 73.46,12.19 73.46,11.35 X1.3
  Top Layer w0.381: 73.24,10.78 73.47,10.78 73.47,9.57 73.24,9.35
OSC_OUT: length 7.6
  Top Layer w0.254: 71.49,13.77 71.47,13.79 70.81,13.79 ; 71.49,13.77 71.61,13.65 ; 71.49,13.77 70.81,13.79 ; 71.61,13.65 X1.1 ; 71.61,13.65 71.79,13.65 ; U13.6 70.81,13.79
  Top Layer w0.381: 71.84,15.49 71.79,15.43 71.79,13.65
PWMN: length 45.1
  Top Layer w0.254: R43.1 18.42,23.67 18.83,23.25 32.73,23.25 v1(32.77,23.29) 32.89,23.17 43.31,23.17 52.19,14.29 U13.42 ; R61.1 32.77,24.56
  Bottom Layer w0.254: v1(32.77,24.69) v1(32.77,23.29)
PWMP: length 44.6
  Top Layer w0.254: v1(31.12,24.69) 31.12,25.44 R60.1 ; v1(20.19,24.44) R45.1 ; v1(20.19,22.67) 20.33,22.53 43.18,22.53 51.92,13.79 U13.43
  Bottom Layer w0.254: v1(31.12,24.69) v1(31.12,22.66) ; v1(20.19,22.67) v1(20.19,24.44)
ROGOWSKI_IN: length 3
  Top Layer w0.254: R40.1 47.13,38.02 U7.1
SW_N1: length 16
  Top Layer w0.381: R14.2 13.58,44.33 R12.2
  Top Layer w0.508: U6.15 v1(20.62,36.25) ; R14.2 13.58,39.68 v1(13.72,39.55)
  Bottom Layer w0.381: v1(20.62,36.25) 20.62,38.61 20.32,38.91 14.35,38.91 v1(13.72,39.55)
SW_N2: length 36.8
  Top Layer w0.381: v1(38.74,36.25) 38.7,36.21 U12.10 ; v1(23.88,53.9) 23.88,57.35 R5.2 23.88,57.36 R3.2
  Bottom Layer w0.381: v1(23.88,53.9) 23.88,50.72 26.03,48.56 26.03,43.1 29.84,39.29 38.56,39.29 38.74,39.12 v1(38.74,36.25)
SW_P1: length 36.2
  Top Layer w0.381: R2.2 13.69,57.16 R4.2 13.61,56.26 15.73,54.14 15.73,40.58 16.13,40.18 21.21,40.18 21.72,39.67 25.78,39.67 v1(26.29,39.17)
  Top Layer w0.508: U6.10 v1(26.97,36.28)
  Bottom Layer w0.381: v1(26.29,39.17) 26.97,38.49 v1(26.97,36.28)
SW_P2: length 16
  Top Layer w0.381: v1(26.16,41.45) 26.1,41.39 R15.2 24.25,44.5 R13.2
  Top Layer w0.508: U12.15 v1(32.35,36.25)
  Bottom Layer w0.381: v1(32.35,36.25) 32.35,38.44 32.26,38.53 29.08,38.53 v1(26.16,41.45)
SWCLK: length 7.7
  Top Layer w0.381: H1.4 59.07,2.06 58.06,3.08 U13.50
SWDIO: length 7.6
  Top Layer w0.381: U13.49 57.56,2.99 H1.5
USART3_RX: length 13.3
  Top Layer w0.381: U13.53 59.56,7.91 ; H1.1 65.01,3.85 59.83,3.85 59.56,4.12 59.56,7.9
USART3_TX: length 11.4
  Top Layer w0.381: U13.52 59.06,3.85 59.63,3.29 63.03,3.29 H1.2
VOUT+: length 184.6
  Top Layer w0.381: R33.1 88.18,4.21 U4.1 ; C11.1 85.46,41.23 84.71,41.99 74.07,41.99 73.15,41.07 R24.1 ; 90.97,38.29 90.97,41.16 88.52,43.61 76.71,43.61 75.93,44.39 75.93,49.95 76.2,50.22 82.55,50.22 84.84,52.5 84.84,55.74
  Top Layer w1.27: C61.1 78.24,69.9 79.38,68.76 U1.6
  Top Layer w2.54: U1.4 79.25,53.69 75.52,53.69 74.93,54.28 74.93,63.89 76.25,65.2 78.99,65.2 79.12,65.08
  Bottom Layer w2.54: 88.18,9.75 88.39,9.96 92.2,9.96 92.2,25.49 90.72,26.98 90.72,39.76 84.33,46.15 84.33,52.38 83.14,53.56 U1.4 ; 79.79,53.14 76.45,53.14 75.06,54.53 75.06,64.06 76.33,65.33 U1.6
VOUT_MCU: length 22.3
  Top Layer w0.254: 75.82,25.36 76.95,25.36 C59.1 ; 75.82,25.36 75.82,24.69 74.12,22.99 71.12,22.99 70.87,22.73 70.87,18.34 69.31,16.79 U13.12 ; 75.82,25.36 R27.2
VOUT_T-: length 89
  Top Layer w0.381: 89.35,55.74 89.79,55.3 89.79,53.55 U5.2 ; 89.35,55.74 94.64,55.74 ; 89.35,55.74 C17.1 ; 94.64,55.74 R37.1 ; 94.64,55.74 C16.1 96.27,55.23 ; 87,35.61 87,40.69 84.71,42.98 72.9,42.98 71.27,41.35 R26.1 ; R18.2 R19.2 ; 89.39,1.53 90.38,1.53 91.82,2.97 91.82,14.91 ; 83.59,16 83.68,16.09
  Top Layer w0.762: 86.7,16.09 86.87,15.93
  Top Layer w1.27: R19.2 86.61,16 86.7,16.09
  Bottom Layer w2.54: U4.2 87.12,17.58 80.46,24.23 C11.2
  vias: v1(96.39,18.31) v1(96.39,17.42) v1(96.39,16.4) v1(96.43,19.23) v1(96.43,15.55) v1(96.77,63.55) v1(96.73,62.63) v1(96.73,61.74) v1(96.73,60.72) v1(96.77,59.87) v1(96.77,47.3) v1(96.73,46.37) v1(96.73,45.48) v1(96.73,44.47) v1(96.77,43.61) v1(96.77,34.47) v1(96.73,33.55) v1(96.73,32.66) v1(96.73,31.64) v1(96.77,30.78) v1(97.28,19.2) v1(97.29,18.31) v1(97.29,17.42) v1(97.29,16.4) v1(97.28,15.51) v1(97.62,63.52) v1(97.63,62.63) v1(97.62,59.84) v1(97.62,47.26) v1(97.63,46.37) v1(97.62,43.58) v1(97.62,34.44) v1(97.63,33.55) v1(97.62,30.75) v1(97.64,61.74) v1(97.64,60.72) v1(97.64,45.48) v1(97.64,44.47) v1(97.64,32.66) v1(97.64,31.64) v1(98.17,19.2) v1(98.17,18.31) v1(98.17,17.42) v1(98.17,16.4) v1(98.17,15.51) v1(98.51,63.52) v1(98.51,62.63) v1(98.51,61.74) v1(98.51,60.72) v1(98.51,59.84) v1(98.51,47.26) v1(98.51,46.37) v1(98.51,45.48) v1(98.51,44.47) v1(98.51,43.58) v1(98.51,34.44) v1(98.51,33.55) v1(98.51,32.66) v1(98.51,31.64) v1(98.51,30.75)
$1N3547: length 10.1
  Top Layer w0.381: 54.68,44.44 55.12,44.88
  Top Layer w2.54: L2.7 54.68,44.44 ; U1.2 54.74,51.87 54.74,44.88
$1N3854: length 21.4
  Top Layer w2.54: U3.2 44.99,58.13 L1.2 51.82,64.57 54.36,62.03 U1.1
$1N4788: length 1.5
  Top Layer w0.381: 22.43,42.75 22.74,42.43 R15.1
$1N4863: length 6.2
  Top Layer w0.381: R17.1 22.43,46.02 ; 22.43,46.02 22.43,46 ; 22.43,46.02 R13.1 ; 22.43,46.02 22.43,47.55 22.42,47.55 Q4.4
$1N5011: length 1.7
  Top Layer w0.381: R4.1 12.1,58.48 11.86,58.72
$1N5012: length 5.8
  Top Layer w0.381: R6.1 13.61,61.85 R2.1 ; Q1.4 11.86,63.95 11.86,61.98
$1N5134: length 1.6
  Top Layer w0.381: 22.1,58.85 22.36,58.59 R5.1
$1N5135: length 5.7
  Top Layer w0.381: Q2.4 22.08,62.08 22.02,62.02 ; 22.02,62.02 R3.1 ; 22.02,62.02 R7.1
$1N5263: length 1.9
  Top Layer w0.381: R14.1 12.07,42.36 11.81,42.62
$1N5264: length 5.9
  Top Layer w0.381: R16.1 11.77,45.95 ; 11.77,45.95 11.77,45.94 ; 11.77,45.95 11.81,45.95 ; 11.77,45.95 Q3.4 ; 11.81,45.95 R12.1 ; 11.81,45.95 11.81,45.87
$1N6284: length 4.4
  Top Layer w0.381: U6.6 25.7,27.03 C27.2 27.27,26.84 27.29,26.83
$1N6302: length 5
  Top Layer w0.381: 37.41,29.54 37.41,27.99 37.68,27.72 37.97,27.72 38.25,27.45 C44.2 40,26.84 40.02,26.83
$1N20334: length 18.2
  Top Layer w0.381: v1(87.63,59.11) 88.49,59.11 U5.8 ; R32.1 94.57,66.52 v1(94.62,66.47)
  Bottom Layer w0.381: v1(87.63,59.11) 87.63,58.09 88.14,57.58 93.34,57.58 94.62,58.85 v1(94.62,66.47)
$1N20497: length 6
  Top Layer w0.381: C16.2 94.44,53.63 94,53.63 93.73,53.9 93.73,54.41 92.95,55.18 91.46,55.18 91.19,54.92 91.19,53.67 U5.3
$1N20724: length 13.3
  Top Layer w0.381: v1(93.47,51.74) 93.47,49.39 R30.1 ; U5.1 88.49,53.52 v1(87.63,53.52)
  Bottom Layer w0.381: v1(93.47,51.74) 93.47,54.53 93.22,54.79 87.88,54.79 87.63,54.53 v1(87.63,53.52)
$1N20775: length 5.4
  Top Layer w0.381: U5.4 92.32,51.73 91.95,51.36 R29.1
$1N20892: length 4
  Top Layer w0.381: U5.6 91.05,61.4 90.68,61.77 R31.1
$1N21002: length 7
  Top Layer w0.381: U5.7 89.93,58.94 89.93,57.41 89.66,57.14 C17.2 86.52,57.25 R35.1
$1N32813: length 1.9
  Top Layer w0.254: U10.3 39.96,16.09 R55.1
$1N33128: length 14.4
  Top Layer w0.254: R11.2 70.74,26.86 C6.1 70.68,27.62 71.12,28.06 U15.2 71.12,30.4 70.54,30.99 63.93,30.99 63.75,31.17 63.75,32.45
$1N33129: length 6.2
  Top Layer w0.254: C6.2 69.28,25.93 69.23,25.88 R11.1 ; C6.2 69.28,27.67 69.85,28.25 U15.1 ; C6.2 69.19,26.83 R10.1
$1N33131: length 13.6
  Top Layer w0.254: R8.2 65.66,31.67 65.79,31.55 71.63,31.55 72.39,30.78 U15.3 72.39,26.95 C1.1 72.31,26.78 R1.1
$1N33376: length 13.8
  Top Layer w0.254: R27.1 71.62,32.7 71.12,33.2 U15.7 71.05,34.74 71.05,36.01 70.87,36.19 68.03,36.19 67.85,36.37 C13.2 67.74,37.42 R34.2
$1N33377: length 6.8
  Top Layer w0.254: C12.1 75.29,39.03 R20.1 75.28,37.4 73.15,37.4 73.15,36.63 73.66,36.12 U15.5
$1N33378: length 7.2
  Top Layer w0.254: U15.6 72.44,34.71 72.44,36.07 72.26,36.25 71.75,36.25 71.37,36.63 71.37,37.22 R26.2 71.26,37.31 C13.1 69.25,37.32 R34.1
$1N34666: length 6.4
  Top Layer w0.254: 58.81,26.41 C26.2 ; 58.81,26.41 R52.2 ; 58.81,26.41 58.64,26.24 R48.1 57.02,28.77 U16.3
$1N34668: length 15.2
  Top Layer w0.381: 61.85,32.29 R47.2 56.16,32.29 55.63,32.82 U16.7 55.63,35.74 55.37,35.99 52.83,35.99 52.56,36.26 52.56,36.64 52.76,36.84 C14.2 52.76,38.56 R39.2
$1N34669: length 10.8
  Top Layer w0.381: 53.53,26.34 55.14,26.34 55.27,26.21 55.63,26.56 U16.2 55.63,30.53 55.88,30.78 60.07,30.78
$1N34670: length 1.8
  Top Layer w0.381: R58.2 55.15,24.58 53.53,24.58
$1N34680: length 15.2
  Top Layer w0.254: R39.1 54.14,39.38 53.92,39.6 49.32,39.6 49.14,39.42 R40.2
  Top Layer w0.381: R40.2 49.14,36.77 R44.2 ; R39.1 54.16,38.67 C14.1 55.91,36.86 56.01,36.96 56.04,36.96 56.9,36.1 U16.6
$1N34683: length 8.4
  Top Layer w0.381: C39.2 52.01,26.22 ; C39.2 C38.2 ; C39.2 52.2,26.41 52.2,27.36 54.23,27.36 54.36,27.48 U16.1 ; C39.2 52.13,28.1 R50.2
$1N36916: length 6.3
  Top Layer w0.381: U16.5 58.17,36.54 R38.2 59.56,36.94 59.72,36.78 ; 59.72,36.78 C19.1 ; 59.72,36.78 R46.1
$1N36921: length 19.3
  Top Layer w0.254: v1(58.22,31.61) 57.91,31.29 52.32,31.29 52.1,31.07 R50.1 51.42,29.63 51.41,29.64 50.42,29.64 50.29,29.52 ; 61.23,36.98 61.21,36.96 v1(61.21,35.74)
  Top Layer w0.381: R46.2 61.23,38.24 C19.2
  Bottom Layer w0.254: v1(61.21,35.74) 58.8,35.74 58.22,35.16 v1(58.22,31.61)
$1N39143: length 1.8
  Top Layer w0.254: R69.2 40.85,20.38 39.1,20.38
$1N39187: length 10.3
  Top Layer w0.254: C56.2 52.83,20.59 R77.2 53.08,22.66 59.06,22.66 59.56,22.15 U13.28
$1N39190: length 2.3
  Top Layer w0.254: R68.2 49.93,11.99 48.44,13.49
$1N42624: length 14.4
  Top Layer w0.254: U13.58 62.06,7.88 v1(60.96,6.78) ; R73.1 v1(55.63,6.17)
  Bottom Layer w0.254: v1(55.63,6.17) 60.35,6.17 v1(60.96,6.78)
$1N42658: length 13.3
  Top Layer w0.254: R74.1 50.23,7.53 55.62,7.53 v1(55.63,7.54) ; v1(60.96,7.67) 61.56,8.27 U13.57
  Bottom Layer w0.254: v1(60.96,7.67) 55.75,7.67 v1(55.63,7.54)
$1N42665: length 17.9
  Top Layer w0.254: R73.2 R74.2 48.37,7.97 48.39,7.95 48.39,8.75 55.18,8.75 57.15,10.72 57.15,14.65 57.02,14.78 55.57,14.78 U13.41
$1N42779: length 2.5
  Top Layer w0.381: R37.2 94.15,59.08 U5.5
$1N43054: length 4.4
  Top Layer w0.381: R21.1 91.83,47.63 R30.2 91.82,49.25 Q5.4
$1N43275: length 11.4
  Top Layer w0.381: R29.2 87.4,48.75 Q5.9
  Top Layer w2.54: Q5.9 85.66,47.68 U1.3
$1N43285: length 14.1
  Top Layer w0.381: R31.2 88.05,64.09 Q6.9
  Top Layer w2.54: U1.5 85.43,65.5 Q6.9
  vias: v1(85.56,66.91) v1(85.56,65.89) v1(85.56,65) v1(85.56,64.12) v1(86.44,66.91) v1(86.44,65.89) v1(86.44,65) v1(86.45,64.12) v1(87.3,64.08) v1(87.34,66.91) v1(87.34,65.89) v1(87.34,65)
$1N43446: length 4.9
  Top Layer w0.381: 93.08,65.96 93.08,67.59 93.05,67.62 92.84,67.41 89.86,67.41
$1N43722: length 3
  Top Layer w0.381: R33.2 89.34,3.08 87.79,1.53
$1N46740: length 9.8
  Top Layer w2.54: L2.8 46.53,43.61 C5.1 C4.1
$1N46839: length 3.4
  Top Layer w0.381: U6.1 19.35,28.13 19.08,27.86 18.54,27.86 18.3,27.62 18.3,26.92 18.22,26.84
$1N46874: length 2.8
  Top Layer w0.381: 20.09,26.84 20.09,27.64 20.62,28.16 U6.2
$1N46906: length 2.7
  Top Layer w0.381: 30.95,26.84 31.06,26.96 31.06,29.54
$1N46935: length 2.9
  Top Layer w0.381: 32.82,26.84 32.33,27.33 32.33,29.54
$1N47459: length 1.9
  Top Layer w0.381: R62.1 18.93,8.14 18.93,6.34
$1N47460: length 16.4
  Top Layer w0.381: U9.7 26.94,18.54 C23.2 29.14,18.47 30.85,18.47 31.12,18.2 31.12,17.04 R49.1
  Top Layer w1.27: L3.1 30.59,13.38 31.11,13.89 R49.1 ; U11.1 31.74,14.27
$1N47463: length 7.3
  Top Layer w0.381: U9.4 21.08,15.87 21.08,14.91 20.7,14.53 R57.2 18.89,11.84 18.83,11.79 18.83,10.97
$1N47464: length 2.4
  Top Layer w0.381: U9.6 28.75,17.45 C23.1
$1N47465: length 4.4
  Top Layer w0.381: R49.2 U9.8
$1N56874: length 42.5
  Top Layer w0.381: R59.2 45.34,31.16 45.35,31.17 45.35,33.58 ; 31.14,37.54 31.14,35.15 31.06,35.08 31.12,35.03 v1(31.12,33.33) ; v1(47.01,33.33) 45.54,33.33 D6.2 ; v1(19.35,33.33) U6.16 19.46,35.06 19.46,37.54
  Bottom Layer w0.381: 47.12,33.33 v1(31.12,33.33) v1(19.35,33.33)
$1N60107: length 21.9
  Top Layer w0.381: 25.56,37.54 25.7,37.4 U6.11 ; 25.65,34.9 25.65,33.06 26.03,32.68 40.74,32.68 D5.1
$1N60158: length 8.6
  Top Layer w0.381: 37.36,37.54 37.41,37.48 37.41,33.76 37.59,33.58 42.12,33.58
$1N60336: length 3.4
  Top Layer w0.254: R71.2 72.43,5.14 H2.2
$1N60338: length 3.5
  Top Layer w0.254: R72.2 70.46,2.66 H2.1
$1N60340: length 3.8
  Top Layer w0.254: R70.2 73.86,4.04 74.97,2.93 H2.3

## Copper pours and planes (outline as drawn; the poured copper is in the pictures)
AGND on Top Layer: 33.96,25.96 42.82,25.96 42.82,24.18 33.96,24.18
AGND on Top Layer: 74.68,16.56 77.62,16.56 77.62,12.88 74.68,12.88
AGND on Top Layer: 35.77,16.92 40.26,16.92 40.26,13.39 35.77,13.39
AGND on Top Layer: 72.89,18.46 74.5,18.46 74.98,17.98 74.98,12.93 74.8,12.75 72.89,12.75
AGND on Top Layer: 21.08,25.96 29.94,25.96 29.94,24.18 21.08,24.18
AGND on Top Layer: 62.36,27.99 66.17,27.99 66.17,26.34 62.36,26.34
AGND on Top Layer: 41.53,36.5 45.97,36.5 45.97,34.21 41.53,34.21
AGND on Top Layer: 59.18,29.77 60.83,29.77 60.83,27.99 59.18,27.99
AGND on Bottom Layer: 17.91,22.78 18.54,22.15 36.71,22.15 39.18,19.68 39.18,10.03 40.6,8.61 46.56,8.61 49.28,5.89 49.28,1.07 82.04,1.07 82.04,16.43 79.5,18.97 75.06,18.97 75.06,37.03 73.93,38.15 42.04,38.15 41.53,37.64 41.53,31.55 40.77,30.78 18.16,30.78 17.91,30.53
AGND on Bottom Layer: 43.41,11.08 46.99,11.08 46.99,8.67 43.41,8.67
VIN- on Top Layer: 30.1,10.59 38.75,10.59 38.75,6.01 30.1,6.01
VIN- on Top Layer: 9.78,18.97 19.69,18.97 19.69,15.67 9.78,15.67
VIN- on Top Layer: 5.72,49.07 10.92,49.07 10.92,42.85 5.72,42.85
VIN- on Top Layer: 17.27,49.07 21.59,49.07 21.59,42.85 17.27,42.85
VIN- on Bottom Layer: 9.78,18.97 16.13,18.97 16.13,15.67 9.78,15.67
VIN- on Bottom Layer: 14.99,21.01 30.86,21.01 35.05,16.81 35.05,8.31 35.81,7.54 42.29,7.54 43.69,6.15 45.85,6.15 46.23,5.77 46.23,3.86 45.72,3.35 14.99,3.35
VIN- on Bottom Layer: 5.72,49.07 21.72,49.07 21.72,42.9 5.72,42.9
VSS1 on Top Layer: 6.35,64.69 12.28,64.69 12.28,52.29 6.35,52.29
VSS1 on Bottom Layer: 6.35,64.69 12.28,64.69 12.28,52.29 6.35,52.29
VSS2 on Top Layer: 16.76,64.69 23.11,64.69 23.11,52.29 16.76,52.29
VSS2 on Bottom Layer: 27.64,51.41 30.94,51.41 30.94,42.53 27.64,42.53
VOUT+ on Top Layer: 81.91,28.75 93.6,28.75 93.6,18.85 81.91,18.85
VOUT+ on Bottom Layer: 77.34,55.8 94.36,55.8 94.36,7.77 77.34,7.77
VOUT_T- on Top Layer: 78.99,41.45 96.9,41.45 96.9,24.82 78.99,24.82
VOUT_T- on Top Layer: 85.98,66.51 99.57,66.51 99.57,13.75 85.98,13.75
VOUT_T- on Bottom Layer: 95.25,64.69 99.54,64.69 99.54,13.62 95.25,13.62
$1N43275 on Top Layer: 77.34,49.71 88.01,49.71 88.01,45.01 77.34,45.01
$1N43285 on Top Layer: 77.09,68 88.77,68 88.77,57.2 77.09,57.2
$1N43285 on Bottom Layer: 77.09,68 88.77,68 88.77,57.2 77.09,57.2
$1N46740 on Bottom Layer: 42.04,50.85 45.34,50.85 45.34,41.97 42.04,41.97

Small or netless copper shapes (teardrops, artwork), in the pictures only: 281 on Top Layer, 67 on Bottom Layer

## Text on the board
Top Silkscreen Layer: PWMP | PWMN | GND | IL | VO
